# Altium schematic sheet Ultrasound.SchDoc
size A4
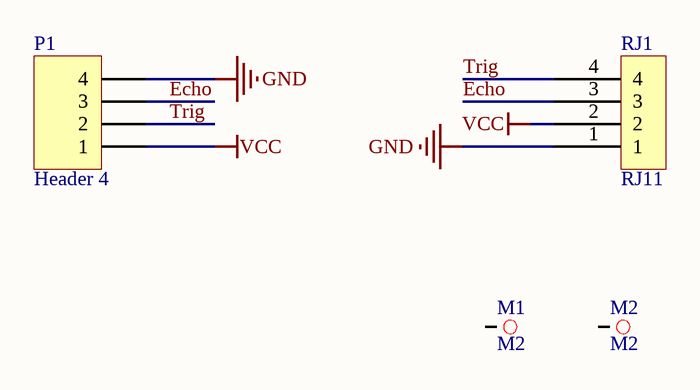
[diagram p0: Ultrasound.SchDoc]

## Parts
M1  M2  [M2]
M2  M2  [M2]
P1  Header 4  [HDR1X4]
RJ1  RJ11  [RJ11]

## Nets
GND: P1.4 RJ1.1
VCC: P1.1 RJ1.2
Echo: P1.3 RJ1.3
Trig: P1.2 RJ1.4

Not connected (* = marked no-connect by the designer): M1 0; M2 0

## Library data of the parts
M1 M2 = M3
P1 = Header 4: Header, 4-Pin; LatestRevisionDate: 17-Jul-2002; LatestRevisionNote: Re-released for DXP Platform.; Publisher: Altium Limited